# Altium project H7-Battery.PrjPcb
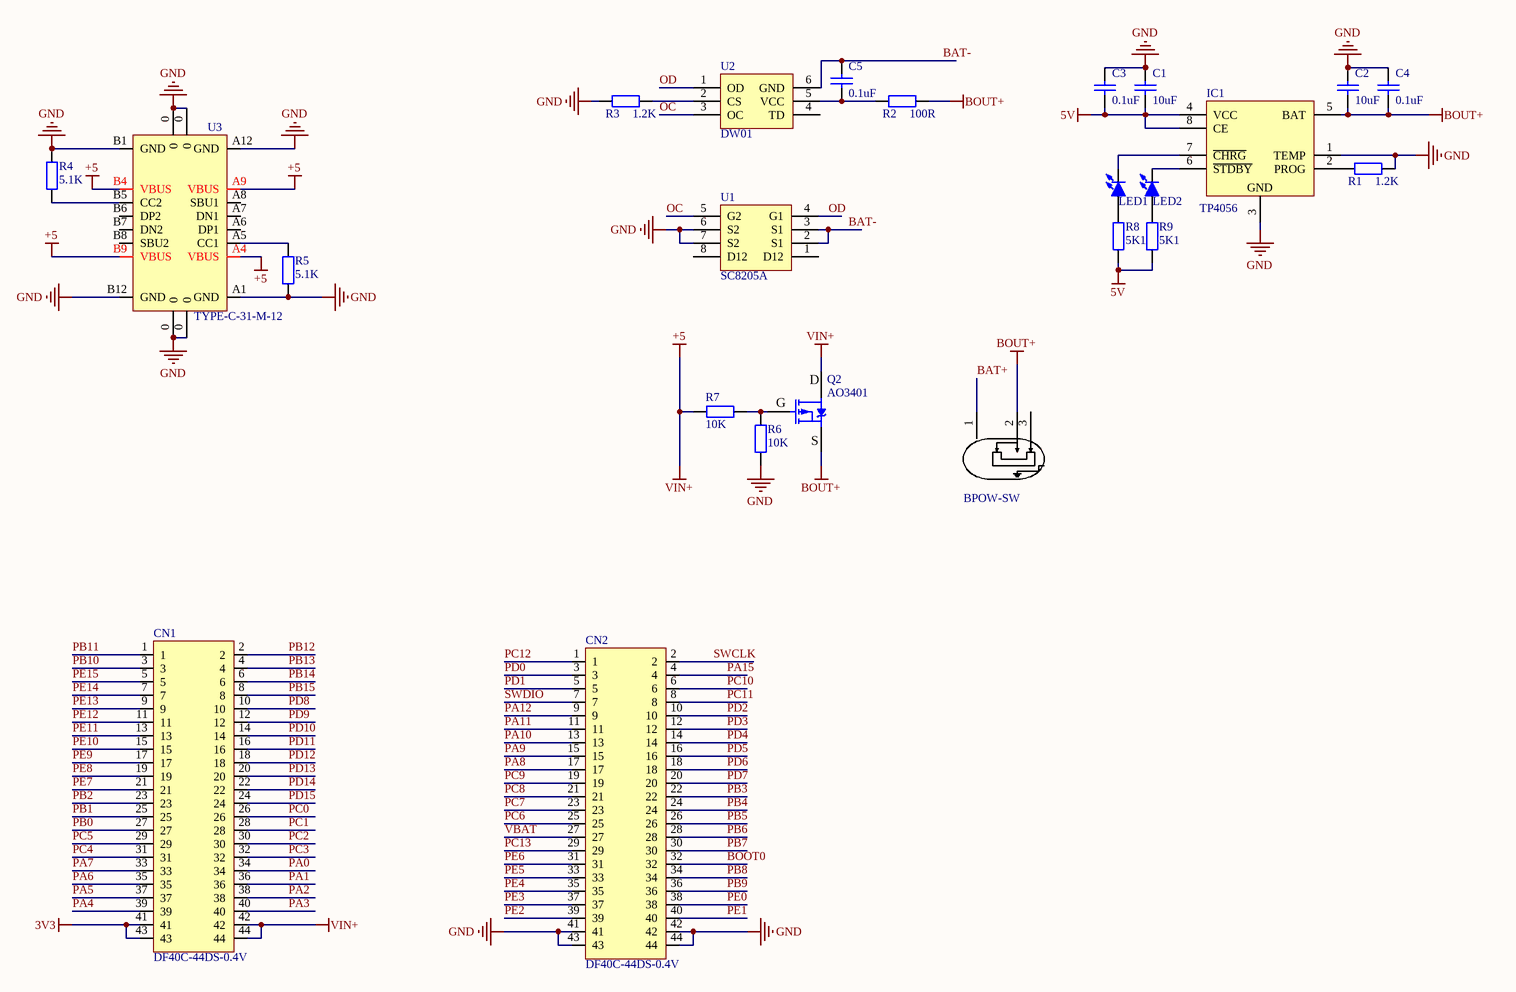
[diagram p0: H7-Battery.SchDoc]
1 sheet, 24 parts. Net scope: global (net labels, ports and power ports of the same name join across sheets).
Board file: H7-Battery.PcbDoc

## Sheet H7-Battery.SchDoc
size A2; SheetNumber: 1; SheetTotal: 1

### Parts
BPOW-SW  MSK12C02  [SW-TH_MSK12C02]  (value not drawn)
C1  10uF  [C0603_L]
C2  10uF  [C0603_L]
C3  0.1uF  [C0603_L]
C4  0.1uF  [C0603_L]
C5  0.1uF  [C0603_L]
CN1  DF40C-44DS-0.4V  [DF40C-44DS-0.4V]
CN2  DF40C-44DS-0.4V  [DF40C-44DS-0.4V]
IC1  TP4056  [ESOP8_L]
LED1  (no value)  [LED0603_R]
LED2  (no value)  [LED0603_G]
Q2  AO3401  [SOT23-3N]
R1  1.2K  [R0603_L]
R2  100R  [R0603_L]
R3  1.2K  [R0603_L]
R4  5.1K  [R0603_L]
R5  5.1K  [R0603_L]
R6  10K  [R0603_L]
R7  10K  [R0603_L]
R8  5K1  [R0603_L]
R9  5K1  [R0603_L]
U1  SC8205A  [TSSOP8_L]
U2  DW01  [SOT23-6L]
U3  TYPE-C-31-M-12  [TYPE-C-31-M-12]

### Nets
3V3: CN1.41 CN1.43
5V: C1.1 C3.1 IC1.4(VCC) IC1.8(CE) R8.1 R9.1
+5: CN1.42 CN1.44 Q2.3(D) R7.2 U3.A4(VBUS) U3.A9(VBUS) U3.B4(VBUS) U3.B9(VBUS)  [also labelled VIN+]
BOUT+: BPOW-SW.2 C2.1 C4.1 IC1.5(BAT) Q2.2(S) R2.2
GND: C1.2 C2.2 C3.2 C4.2 CN2.41 CN2.42 CN2.43 CN2.44 IC1.1(TEMP) IC1.3(GND) R1.2 R3.1 R4.2 R5.1 R6.1 U1.6(S2) U1.7(S2) U3.0 U3.A1(GND) U3.A12(GND) U3.B1(GND) U3.B12(GND)
BAT+: BPOW-SW.1
BAT-: C5.2 U1.2(S1) U1.3(S1) U2.6(GND)
BOOT0: CN2.32
OC: U1.5(G2) U2.3(OC)
OD: U1.4(G1) U2.1(OD)
PA0: CN1.34
PA1: CN1.36
PA2: CN1.38
PA3: CN1.40
PA4: CN1.39
PA5: CN1.37
PA6: CN1.35
PA7: CN1.33
PA8: CN2.17
PA9: CN2.15
PA10: CN2.13
PA11: CN2.11
PA12: CN2.9
PA15: CN2.4
PB0: CN1.27
PB1: CN1.25
PB2: CN1.23
PB3: CN2.22
PB4: CN2.24
PB5: CN2.26
PB6: CN2.28
PB7: CN2.30
PB8: CN2.34
PB9: CN2.36
PB10: CN1.3
PB11: CN1.1
PB12: CN1.2
PB13: CN1.4
PB14: CN1.6
PB15: CN1.8
PC0: CN1.26
PC1: CN1.28
PC2: CN1.30
PC3: CN1.32
PC4: CN1.31
PC5: CN1.29
PC6: CN2.25
PC7: CN2.23
PC8: CN2.21
PC9: CN2.19
PC10: CN2.6
PC11: CN2.8
PC12: CN2.1
PC13: CN2.29
PD0: CN2.3
PD1: CN2.5
PD2: CN2.10
PD3: CN2.12
PD4: CN2.14
PD5: CN2.16
PD6: CN2.18
PD7: CN2.20
PD8: CN1.10
PD9: CN1.12
PD10: CN1.14
PD11: CN1.16
PD12: CN1.18
PD13: CN1.20
PD14: CN1.22
PD15: CN1.24
PE0: CN2.38
PE1: CN2.40
PE2: CN2.39
PE3: CN2.37
PE4: CN2.35
PE5: CN2.33
PE6: CN2.31
PE7: CN1.21
PE8: CN1.19
PE9: CN1.17
PE10: CN1.15
PE11: CN1.13
PE12: CN1.11
PE13: CN1.9
PE14: CN1.7
PE15: CN1.5
SWCLK: CN2.2
SWDIO: CN2.7
VBAT: CN2.27
NetC5_1: C5.1 R2.1 U2.5(VCC)
NetIC1_2: IC1.2(PROG) R1.1
NetIC1_6: IC1.6(~{STDBY}) LED2.2(K)
NetIC1_7: IC1.7(~{CHRG}) LED1.2(K)
NetLED1_1: LED1.1(A) R8.2
NetLED2_1: LED2.1(A) R9.2
NetQ2_1: Q2.1(G) R6.2 R7.1
NetR3_2: R3.2 U2.2(CS)
NetR4_1: R4.1 U3.B5(CC2)
NetR5_2: R5.2 U3.A5(CC1)

Not connected (* = marked no-connect by the designer): BPOW-SW 3; U1 1(D12) 8(D12); U2 4(TD); U3 A6(DP1) A7(DN1) A8(SBU1) B6(DP2) B7(DN2) B8(SBU2)

### Library data of the parts
BPOW-SW = MSK12C02: Manufacturer: SHOU HAN(首韩); Add into BOM: yes; Symbol: MSK12C02; Device: MSK12C02; LCSC Part Name: 两档侧拨贴片 7脚 拨动 白柄 柄长1.5mm,带定位柱; Supplier Part: C431540; Manufacturer Part: MSK12C02; Supplier Footprint: SMD; Datasheet: https://atta.szlcsc.com/upload/public/pdf/source/20190925/C431540_89155AEF0758B9AD1B2D805F83FB12E3.pdf; Supplier: LCSC; Convert to PCB: yes; JLCPCB Part Class: Extended Part
C1-C5 = C: 贴片电容; BOM名称: 无极性贴片电容; 联系卖家，免费查找封装: 唯一出售店铺网址https://shop463601444.taobao.com; 封装库来自淘宝卖家ID：黄晶宝石: 其他店铺购入均为盗版假冒封装库，请立即申请退款
CN1 CN2 = DF40C-44DS-0.4V: 母座
IC1 = TP4056: 锂电池充电管理
LED1 LED2 = LED-SMD: 贴片LED; 封装库来自淘宝卖家 ID：黄晶宝石: 其他店铺购入均为假冒，请立即申请退款，本店奖励现金5~20元; BOM名称: 贴片LED
Q2 = AO3401: P沟道 30V/4.2A; BOM名称: 场效应管; 封装库来自淘宝卖家 ID：黄晶宝石: 其他店铺购入均为盗版，不享受售后技术支持服务，请立即申请退款; 联系卖家，免费查找封装: 唯一出售店铺网址https://shop463601444.taobao.com; 参数: P沟道 30V/4.2A
R1-R9 = R: 贴片电阻; 联系卖家，免费查找封装: 唯一出售店铺网址https://shop463601444.taobao.com; 封装库来自淘宝卖家ID：黄晶宝石: 其他店铺购入均为盗版假冒封装库，请立即申请退款; BOM名称: 贴片电阻
U1 = SC8205A: N沟道 6A/20V锂电池保护板用的MOS管; BOM名称: 场效应管; 联系卖家，免费查找封装: 唯一出售店铺网址https://shop463601444.taobao.com; 封装库来自淘宝卖家 ID：黄晶宝石: 其他店铺购入均为盗版，不享受售后技术支持服务，请立即申请退款
U2 = DW01: 锂电池过流保护IC; BOM名称: 过流保护IC; 封装库来自淘宝卖家 ID：黄晶宝石: 其他店铺购入均为盗版，请立即申请退款，本店现金奖励5~20元; 联系卖家 免费查找封装: 唯一出售店铺网址https://shop463601444.taobao.com